# Altium schematic sheet MCU.SchDoc
size A3; SheetNumber: 2; SheetTotal: 6
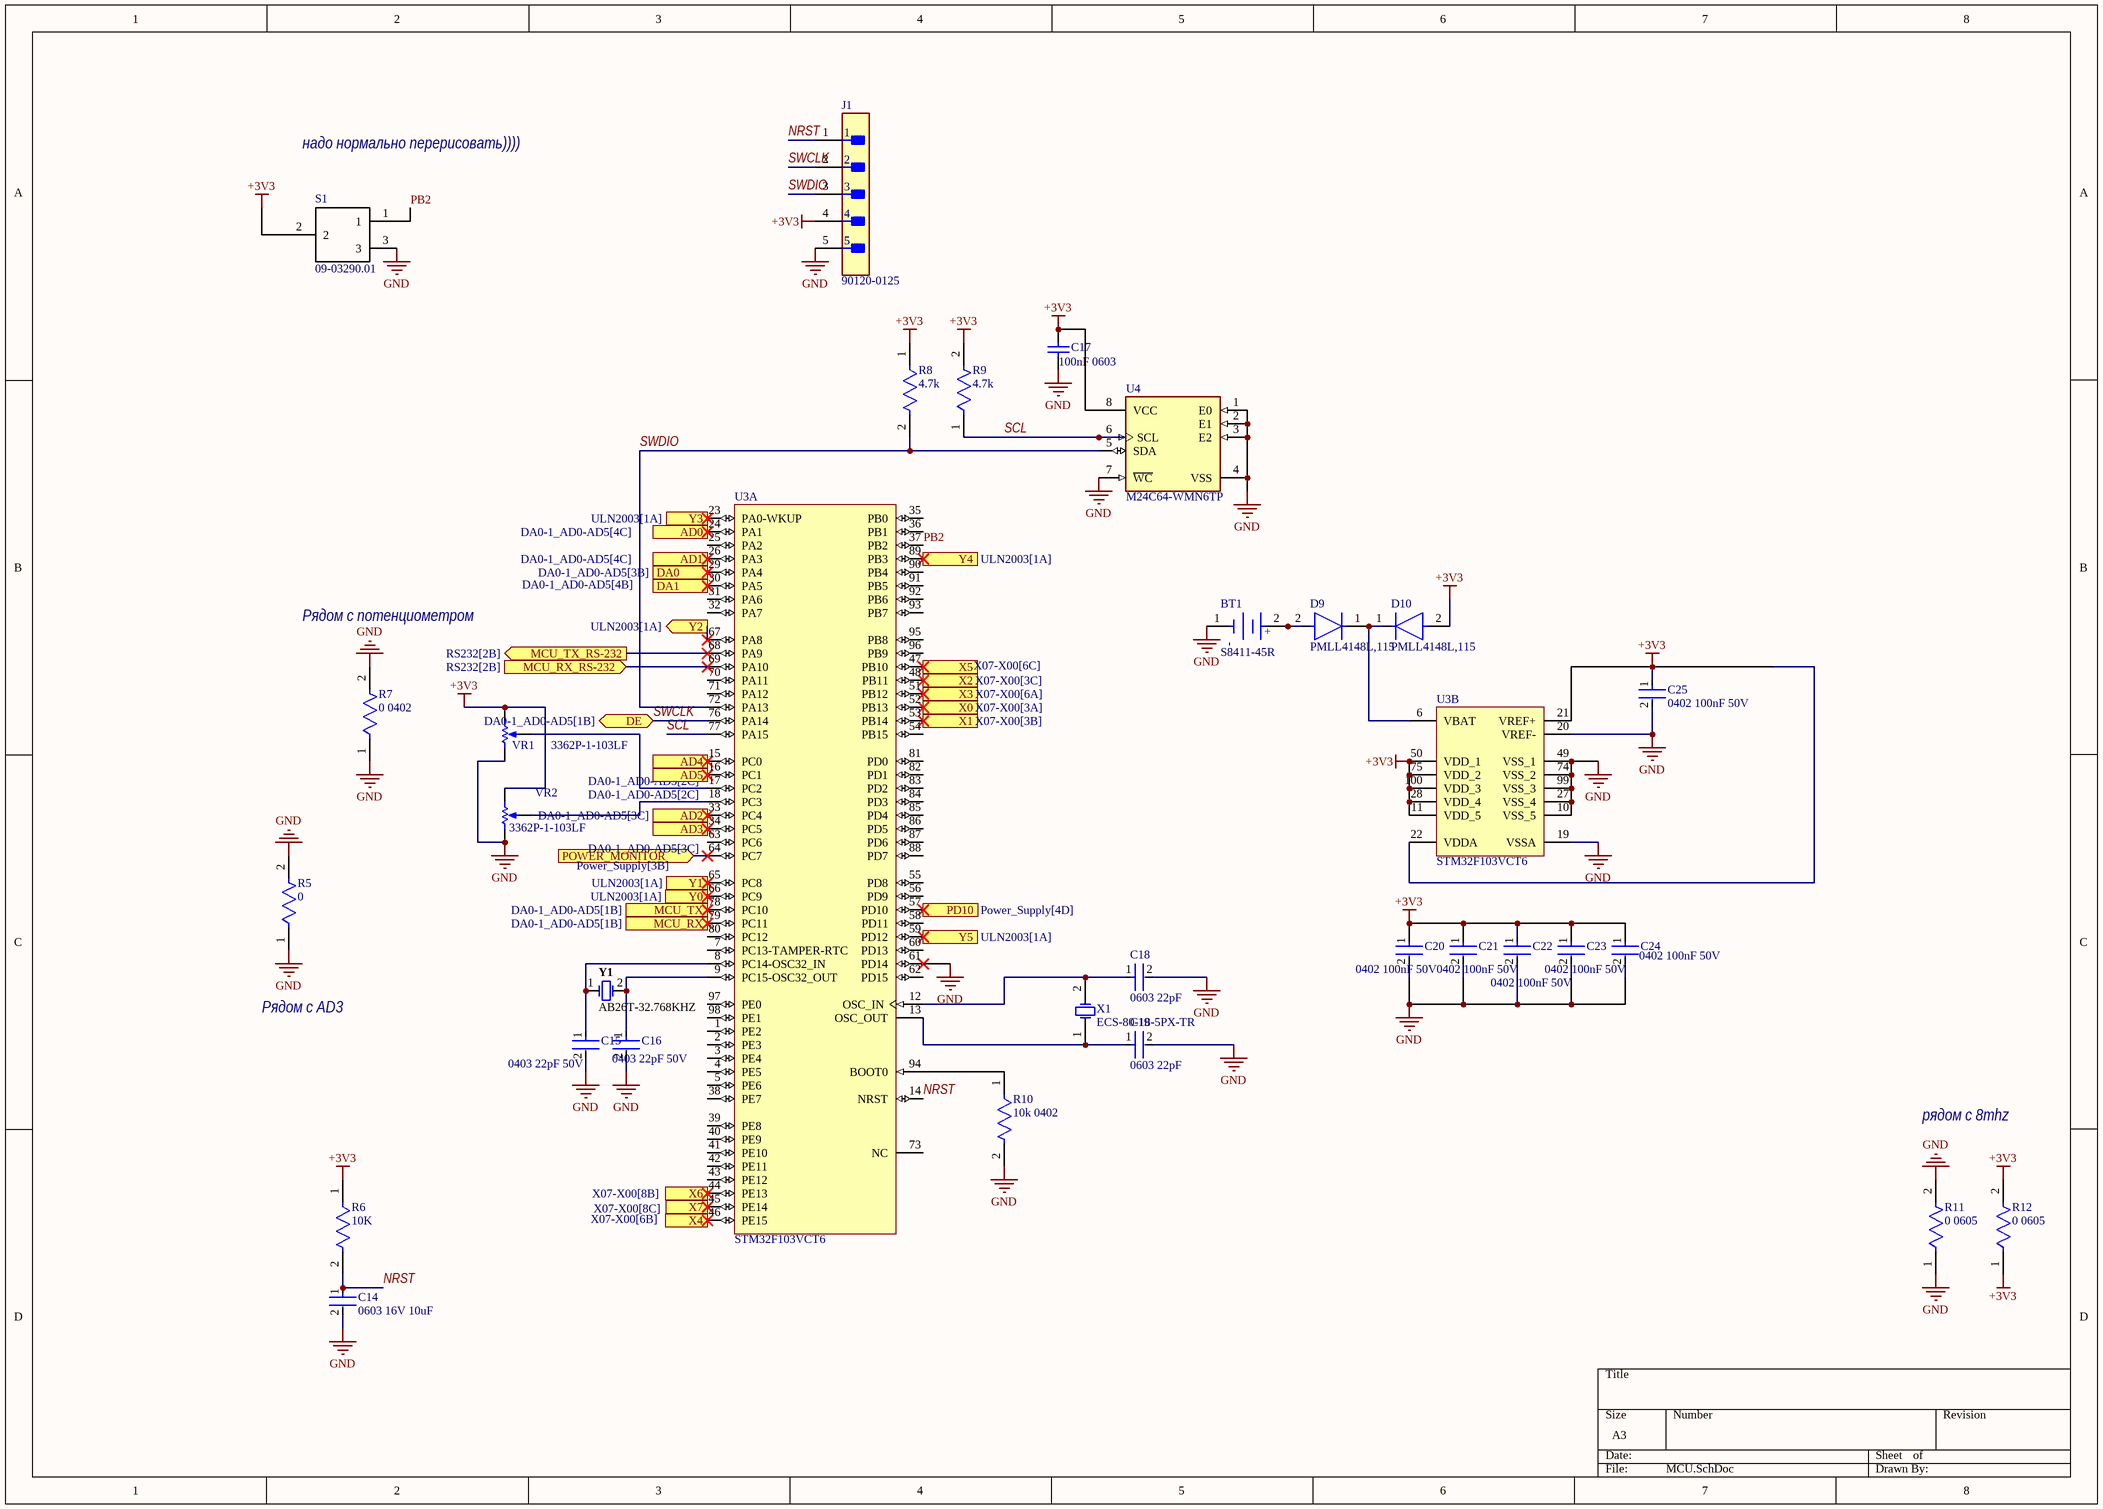
[diagram p0: MCU.SchDoc]

## Parts
BT1  S8411-45R  [FP-S8411-45R-MFG]
C14  0603 16V 10uF  [FP-CC0603-DC-MFG]
C15  0403 22pF 50V  [FP-C0402-BB-MFG]
C16  0403 22pF 50V  [FP-C0402-BB-MFG]
C17  100nF 0603  [CAPC1608X90X35LL15T15]
C18  0603 22pF  [FP-C0603C-CF-MFG]
C19  0603 22pF  [FP-C0603C-CF-MFG]
C20  0402 100nF 50V  [FP-0402B104K500CT-IPC_C]
C21  0402 100nF 50V  [FP-0402B104K500CT-IPC_C]
C22  0402 100nF 50V  [FP-0402B104K500CT-IPC_C]
C23  0402 100nF 50V  [FP-0402B104K500CT-IPC_C]
C24  0402 100nF 50V  [FP-0402B104K500CT-IPC_C]
C25  0402 100nF 50V  [FP-0402B104K500CT-IPC_C]
D9  PMLL4148L,115  [FP-SOD80C-MFG]
D10  PMLL4148L,115  [FP-SOD80C-MFG]
J1  90120-0125  [FP-90120-0125-MFG]
R5  0  [FP-RCS0603-e3-MFG]
R6  10K  [FP-RT0603-MFG]
R7  0 0402  [FP-PMR01-MFG]
R8  4.7k  [FP-TFCR0402-IPC_A]
R9  4.7k  [FP-TFCR0402-IPC_A]
R10  10k 0402  [FP-MCS0402-MFG]
R11  0 0605  [FP-HCJ0603-MFG]
R12  0 0605  [FP-HCJ0603-MFG]
S1  09-03290.01  [09.03290.01]
U3  STM32F103VCT6  [STM-LQFP100_L]  (parts A,B of 2)
U4  M24C64-WMN6TP  [FP-SO8N-SO-A-MFG]
VR1  3362P-1-103LF  [BOUR-3362P]
VR2  3362P-1-103LF  [BOUR-3362P]
X1  ECS-80-18-5PX-TR  [ECS-80-18-5PX-TR_V]
Y1  AB26T-32.768KHZ  [ABRA-AB26T]

## Ports
AD0 (in, see DA0-1_AD0-AD5[4C]), AD1 (in, see DA0-1_AD0-AD5[4C]), AD2 (in, see DA0-1_AD0-AD5[3C]), AD3 (in, see DA0-1_AD0-AD5[3C]), AD4 (in, see DA0-1_AD0-AD5[2C]), AD5 (in, see DA0-1_AD0-AD5[2C]), DA0 (out, see DA0-1_AD0-AD5[3B]), DA1 (out, see DA0-1_AD0-AD5[4B]), DE (bidir, see DA0-1_AD0-AD5[1B]), MCU_RX (in, see DA0-1_AD0-AD5[1B]), MCU_RX_RS-232 (in, see RS232[2B]), MCU_TX (out, see DA0-1_AD0-AD5[1B]), MCU_TX_RS-232 (out, see RS232[2B]), PD10 (out, see Power_Supply[4D]), POWER_MONITOR (in, see Power_Supply[3B]), X0 (in, see X07-X00[3A]), X1 (in, see X07-X00[3B]), X2 (in, see X07-X00[3C]), X3 (in, see X07-X00[6A]), X4 (in, see X07-X00[6B]), X5 (in, see X07-X00[6C]), X6 (in, see X07-X00[8B]), X7 (in, see X07-X00[8C]), Y0 (out, see ULN2003[1A]), Y1 (out, see ULN2003[1A]), Y2 (out, see ULN2003[1A]), Y3 (out, see ULN2003[1A]), Y4 (out, see ULN2003[1A]), Y5 (out, see ULN2003[1A])

## Nets
+3V3: C17.2 C20.1 C21.1 C22.1 C23.1 C24.1 C25.1 D10.2(A) J1.4 R6.1 R8.1 R9.2 R12.1 R12.2 S1.2 U3.11(VDD_5) U3.21(VREF+) U3.22(VDDA) U3.28(VDD_4) U3.50(VDD_1) U3.75(VDD_2) U3.100(VDD_3) U4.8(VCC) VR1.3(CW) VR2.3(CW)
GND: BT1.1(C) C14.2 C15.2 C16.2 C17.1 C18.2 C19.2 C20.2 C21.2 C22.2 C23.2 C24.2 C25.2 J1.5 R5.1 R5.2 R7.1 R7.2 R10.2 R11.1 R11.2 S1.3 U3.10(VSS_5) U3.19(VSSA) U3.20(VREF-) U3.27(VSS_4) U3.49(VSS_1) U3.61(PD14) U3.74(VSS_2) U3.99(VSS_3) U4.1(E0) U4.2(E1) U4.3(E2) U4.4(VSS) U4.7(~{WC}) VR1.1(CCW) VR2.1(CCW)
AD0: U3.24(PA1) ; port AD0
AD1: U3.26(PA3) ; port AD1
AD2: U3.33(PC4) ; port AD2
AD3: U3.34(PC5) ; port AD3
AD4: U3.15(PC0) ; port AD4
AD5: U3.16(PC1) ; port AD5
DA0: U3.29(PA4) ; port DA0
DA1: U3.30(PA5) ; port DA1
MCU_RX: U3.79(PC11) ; port MCU_RX
MCU_RX_RS-232: U3.69(PA10) ; port MCU_RX_RS-232
MCU_TX: U3.78(PC10) ; port MCU_TX
MCU_TX_RS-232: U3.68(PA9) ; port MCU_TX_RS-232
NRST: C14.1 J1.1 R6.2 U3.14(NRST)
PB2: S1.1 U3.37(PB2)
PD10: U3.57(PD10) ; port PD10
POWER_MONITOR: U3.64(PC7) ; port POWER_MONITOR
SCL: R9.1 U3.77(PA15) U4.6(SCL)
SWCLK: J1.2 U3.76(PA14) ; port DE
SWDIO: J1.3 R8.2 U3.72(PA13) U4.5(SDA)
X0: U3.52(PB13) ; port X0
X1: U3.53(PB14) ; port X1
X2: U3.48(PB11) ; port X2
X3: U3.51(PB12) ; port X3
X4: U3.46(PE15) ; port X4
X5: U3.47(PB10) ; port X5
X6: U3.44(PE13) ; port X6
X7: U3.45(PE14) ; port X7
Y0: U3.66(PC9) ; port Y0
Y1: U3.65(PC8) ; port Y1
Y2: U3.67(PA8) ; port Y2
Y3: U3.23(PA0-WKUP) ; port Y3
Y4: U3.89(PB3) ; port Y4
Y5: U3.59(PD12) ; port Y5
NetBT1_2: BT1.2(A) D9.2(A)
NetC15_1: C15.1 U3.8(PC14-OSC32_IN) Y1.1
NetC16_1: C16.1 U3.9(PC15-OSC32_OUT) Y1.2
NetC18_1: C18.1 U3.12(OSC_IN) X1.2(X2)
NetC19_1: C19.1 U3.13(OSC_OUT) X1.1(X1)
NetD9_1: D9.1(C) D10.1(C) U3.6(VBAT)
NetR10_1: R10.1 U3.94(BOOT0)
NetU3_17: U3.17(PC2) VR1.2(S)
NetU3_18: U3.18(PC3) VR2.2(S)

Not connected (* = marked no-connect by the designer): U3 1(PE2) 2(PE3) 3(PE4) 4(PE5) 5(PE6) 7(PC13-TAMPER-RTC) 25(PA2) 31(PA6) 32(PA7) 35(PB0) 36(PB1) 38(PE7) 39(PE8) 40(PE9) 41(PE10) 42(PE11) 43(PE12) 54(PB15) 55(PD8) 56(PD9) 58(PD11) 60(PD13) 62(PD15) 63(PC6) 70(PA11) 71(PA12) 73(NC) 80(PC12) 81(PD0) 82(PD1) 83(PD2) 84(PD3) 85(PD4) 86(PD5) 87(PD6) 88(PD7) 90(PB4) 91(PB5) 92(PB6) 93(PB7) 95(PB8) 96(PB9) 97(PE0) 98(PE1)

## Notes on the sheet
- надо нормально перерисовать))))
- Рядом с потенциометром
- Рядом с AD3
- рядом с 8mhz
- (in symbol CMP-15817-000007-1) +; -

## Library data of the parts
BT1 = CMP-15817-000007-1: BATTERY HOLDER COIN 12MM SMD; Number of Batteries: 1; Material: Polyphenylene; Case/Package: SMD/SMT; Number of Cells: 1; Min Operating Temperature: -55°C; Termination: SMD/SMT; REACH SVHC: No SVHC; Contact Plating: Bronze; Package Quantity: 500; Max Operating Temperature: 105°C; Mount: Surface Mount; Packaging: Tape and Reel
C14 = CMP-00621-81932632-1: CC0603KRX5R7BB106 Multilayer Ceramic Capacitor, 10 uF, 16 V, ± 10%, X5R, 0603 [1608 Metric]; Capacitance: 10µF; NexarPartId: 81932632; Height: 1mm; Halogen Free: Halogen Free; Voltage Rating: 16V; Dielectric: X5R; Max Operating Temperature: 85°C; Voltage Rating (DC): 16V; Material: Ceramic; Lead Free: Lead Free; Tolerance: 10%; RoHS: Non-Compliant; Min Operating Temperature: -55°C; Case/Package: 0603
C15 C16 = CMP-03020-023432-1: C0402 22 pF C0G 5.00% 50 V; Manufacturer: Kemet; Manufacturer Part Number: C0402C220J5GAC; Tolerance: 0.05; Temperature Coefficient: 15%; Material: Ceramic; Lead Free: Yes; Package: C0402-BB; Device Class L3: Ceramic Capacitors; Mouser Description: Cap Ceramic 22pF 50V C0G 5% Pad SMD 0402 125C Bulk; Ipc Land Pattern Name: CAPC10050X50; Device Class L2: Capacitors; Device Class L1: Passive Components; Height: 0.55mm; Temperature Characteristic: C0G; Voltage Rating: 50 V; Automotive: No; ComponentLink2Description: Datasheet; Capacitance: 22 pF; Temperature Range Low: -55°C; Category: Cap; Value: 22 pF; Temperature: -55°C to +125°C; Octopart: https://octopart.com/c0402c220j5gac-kemet-3919113; RoHS: TRUE; ComponentLink2URL: https://content.kemet.com/datasheets/KEM_C1002_X7R_SMD.pdf; Temperature Range High: +125°C
C17 = CMP-2006-04391-1: Manufacturer: AVX Interconnect / Elco; Part Number: 06035C104KAZ2A
C18 C19 = CMP-03020-000148-1: C0603 22 pF X7R 30ppm/°C 5.00% 50 V; Manufacturer: KEMET; Manufacturer Part Number: C0603C220J5RACTU; Automotive Grade: Grade 1; Voltage Rating: 50 V; Tolerance: 0.05; Material: Ceramic; ComponentLink2Description: Datasheet; RoHS: TRUE; Octopart: https://octopart.com/c0603c220j5ractu-kemet-47052364; Temperature Range High: +125°C; Lead Free: Yes; Temperature Range Low: -55°C; Category: Cap; Automotive: Yes; Value: 22 pF; Package: C0603C-CF; Device Class L3: Ceramic Capacitors; Device Class L1: Passive Components; Temperature Characteristic: X7R; Capacitance: 22 pF; Device Class L2: Capacitors; Temperature: -55°C to +125°C; Height: 0.87mm; Temperature Coefficient: 30ppm/°C; ComponentLink2URL: https://api.kemet.com/component-edge/download/datasheet/C0603C100J5GACAUTO.pdf
C20-C25 = CMP-45632-000010-1: CAP CER 0.1UF 50V X7R 0402; Tolerance: 10%; Max Operating Temperature: 125°C; Case Code (Metric): 1005; RoHS Compliant: Yes; Series: -; Case Code (Imperial): 0402; Voltage Rating: 50V; Min Operating Temperature: -55°C; Mount: Surface Mount; Capacitance: 100nF; Case/Package: 0402; Packaging: Cut Tape
D9 D10 = CMP-14399-000003-1: DIODE GEN PURP 75V 200MA LLDS; Manufacturer: Nexperia; Max Junction Temp: +200°C; Capacitance: 4pF; Peak Reverse Current: 0.025uA; Value: 4pF; Max Surge Forward Current: 0.5A; Max Repetitive Reverse Voltage: 100V; Ambient Temperature Range Low: -65°C; Octopart: https://octopart.com/pmll4148l%2C115-nexperia-78741557; ComponentLink2URL: https://assets.nexperia.com/documents/data-sheet/PMLL4148L_PMLL4448.pdf; Ambient Temperature Range High: +200°C; Reverse Voltage: 75V; Device Class L2: Diodes; Height: 1.6mm; Package: SOD80C; Device Class L1: Discrete Semiconductors; Digikey Description: DIODE GEN PURP 75V 200MA LLDS; Lead Free: Yes; Manufacturer Part Number: PMLL4148L,115; Temperature Range High: +200°C; Forward Current: 200mA; ComponentLink2Description: Datasheet; Device Class L3: Rectifier Diodes; Temperature: to +200°C; Automotive: No; RoHS: TRUE; Category: Diode; Footprint Url: https://assets.nexperia.com/documents/outline-drawing/SOD80C.pdf
J1 = CMP-00257-00655425-1: 90120-0125 2.54mm Pitch C-Grid III Header, Single Row, Vertical, 5 Circuits, Tin (Sn) Plating; NexarPartId: 655425; Manufacturer Lifecycle Status: ACTIVE; Lead Length: 2.9mm; Number of Positions: 5; Current Rating: 3A; Mating Post Length: 6.75mm; Glow Wire Compliant: Non-compliant; Contact Resistance: 20mΩ; Voltage Rating: 350V; Gender: Male; Max Voltage Rating (DC): 350.35kV; Max Operating Temperature: 125°C; Number of Pins: 5; Plating: Tin; Contact Material: Brass; Mount: Through Hole; Contact Gender: Male; Packaging: Bulk; Schedule B: 8536694040; Lifecycle Status: Production; Lead Pitch: 2.54mm; Radiation Hardening: No; Orientation: Vertical; Min Operating Temperature: -55°C; Country of Origin: SK; Housing Color: Black; REACH SVHC: No SVHC; Contact Plating: Tin; Number of Rows: 1; Number of Circuits: 5; Termination: Solder; Number of Contacts: 5; Pitch: 2.54mm; Housing Material: Polyester; RoHS: Compliant; Lead Free: Lead Free; Voltage Rating (AC): 350V
R5 = CMP-02407-013117-1: RES SMD 0 OHM JUMPER 1/4W 0603; Max Power Dissipation: 250mW; Resistance: 0R; Case Code (Metric): 1608; Packaging: Cut Tape; RoHS Compliant: Yes; Ratings: AEC-Q200; Max Operating Temperature: 155°C; Resistor Type: Thick Film; Features: Automotive AEC-Q200; Case Code (Imperial): 0603; Number of Terminations: 2; Min Operating Temperature: -55°C; Width: 0.033inch; Height: 0.02inch; Series: RCS e3; Length: 0.061inch; Case/Package: 0603
R6 = CMP-03412-024743-1: RES SMD 10K OHM 0.05% 1/10W 0603; Manufacturer: Yageo; Manufacturer Part Number: RT0603WRE0710KL; Power Rating: 0.1W; Value: 10KΩ; Voltage Rating: 75V; Tolerance: 0.0005; Temperature Coefficient: 50 ppm/°C; Height: 0.55mm; ComponentLink2URL: http://www.yageo.com/documents/recent/PYu-RT_1-to-0.01_RoHS_L_9.pdf; Mouser Description: Res SMD 10K Ohm 0.05% 1/10W 0603; Device Class L1: Passive Components; Octopart: https://octopart.com/rt0603wre0710kl-yageo-71396825; Lead Free: Yes; RoHS: TRUE; ComponentLink2Description: Datasheet; Package: RT0603; Ipc Land Pattern Name: RESC16080X45; Automotive: No; Temperature: -55°C to +155°C; Series: RT; Resistance: 10KΩ; Footprint Url: http://www.yageo.com/exep/pages/download/literatures/PYu-R_Mount_10.pdf; Temperature Range Low: -55°C; Digikey Description: RES SMD 10K OHM 0.05% 1/10W 0603; Category: Res; Device Class L3: Chip SMD Resistors; Temperature Range High: +155°C; Device Class L2: Resistors; Composition: Thin Film
R7 = CMP-08839-031884-1: RES SMD 0 OHM JUMPER 1/5W 0402; Temperature Coefficient: 200ppm/°C; Resistance: 0mR; Max Power Dissipation: 200mW; Case/Package: 0402; Max Operating Temperature: 155°C; Features: Automotive AEC-Q200; Packaging: Tape and Reel; Case Code (Imperial): 0402; Height: 0.01inch; Number of Terminations: 2; Case Code (Metric): 1005; Resistor Type: Thick Film; Length: 0.039inch; RoHS Compliant: Yes; Min Operating Temperature: -55°C; Width: 0.02inch
R8 R9 = CMP-250906-194630-1: RES Thin Film,  4.7kΩ, 0.5%, 0.063W, 25ppm/°C, 0402
R10 = CMP-02407-000363-1: RES SMD 1.2K OHM 1% 1/10W 0402; Power Rating: 100mW; Temperature Coefficient: 25ppm/°C; Tolerance: 0.5%; Voltage Rating: 50V; Resistance: 10kR; Package Quantity: 10000; Case Code (Metric): 1005; Height: 0.015inch; Termination: SMD/SMT; Features: Automotive AEC-Q200; Packaging: Tape and Reel; Length: 0.039inch; Min Operating Temperature: -55°C; Case/Package: 0402; Max Power Dissipation: 100mW; Case Code (Imperial): 0402; Width: 0.5mm; Contact Plating: Tin; Weight: 2.1E-05oz; Max Operating Temperature: 175°C; Composition: Thin Film; Number of Terminations: 2; Radiation Hardening: No
R11 R12 = CMP-26527-000122-1: RES 0 OHM JUMPER 1/4W 0603; Resistance: 0mR; Termination: Wraparound; Mount: Surface Mount; Min Operating Temperature: -55°C; Number of Terminations: 2; Packaging: Tape and Reel; Case Code (Imperial): 0603; Height: 0.021inch; RoHS Compliant: Yes; Width: 0.031inch; Package Quantity: 5000; Max Operating Temperature: 155°C; Radiation Hardening: No; Case/Package: 0603; Length: 0.061inch; Case Code (Metric): 1608
S1 = 09-03290.01: Switch; Manufacturer_Name: EOZ; Manufacturer_Part_Number: 09-03290.01
U3 = CMP-0237-00164-3: ARM Cortex-M3 32-bit MCU, 256 KB Flash, 48 KB Internal RAM, 80 I/Os, 100-pin LQFP, -40 to 85 degC, Tray; FLASH Size (Prog) (kB): 256; I/Os (High Current): 80; Supply Voltage(Vcc) min (V): 2; Operating Frequency(F) (Processor speed) (MHz): 72; Internal RAM Size (kB): 48; A/D Converter: 3x12-bit (16 Channel); D/A Converter: 2x12-bit (2 Channel); PartNumber: STM32F103VCT6; ComponentLink2URL: http://www.st.com/st-web-ui/static/active/en/resource/technical/document/datasheet/CD00191185.pdf; Packing: Tray; ComponentLink3Description: Package Specification; PackageReference: LQFP100; ComponentLink1Description: Manufacturer URL; ComponentLink2Description: Datasheet; PackageDescription: 100-Pin Low Profile Quad Flat Package, 14 x 14 mm Body, 0.5 mm Pitch; DatasheetVersion: Rev. 8; Core: ARM Cortex-M3; ComponentLink1URL: http://www.st.com/web/en/home.html; ComponentLink3URL: http://www.st.com/st-web-ui/static/active/en/resource/technical/document/data_brief/DM00071938.pdf; Mounting Technology: Surface Mount; PackageVersion: Rev. 1, 06/2013
U4 = CMP-12142-000011-1: IC EEPROM 64K I2C 1MHZ 8SO; Manufacturer: STMicroelectronics; Max Supply Voltage: 5.5V; Nominal Supply Current: 2-2.5mA; Min Supply Voltage: 2.5V; Standoff Height: 0.1mm; Memory Size: 64Kbits; Access Time: 900ns; Temperature Range High: +85°C; Mouser Description: EEPROM EEPROM S. I2C 64k; Height: 1.75mm; ComponentLink2Description: Datasheet; Package: SO8N-SO-A; Ipc Land Pattern Name: SOIC127P600X175-8; Lead Free: Yes; Manufacturer Part Number: M24C64-WMN6TP; Temperature Range Low: -40°C; Category: IC; Octopart: https://octopart.com/m24c64-wmn6tp-stmicroelectronics-55412559; Temperature: -40°C to +85°C; Memory Type: EEPROM; Device Class L2: Memory; ComponentLink2URL: https://www.st.com/content/ccc/resource/technical/document/datasheet/5c/df/52/a5/15/f2/48/bd/CD00259166.pdf/files/CD00259166.pdf/jcr:content/translations/en.CD00259166.pdf; Interface: I2C; Frequency: 1MHz; Ambient Temperature Range Low: -40°C; Digikey Description: IC EEPROM 64K I2C 1MHZ 8SO; Device Class L3: EEPROM; Automotive: No; Ambient Temperature Range High: +85°C; Device Class L1: Integrated Circuits (ICs); RoHS: TRUE
VR1 VR2 = CMP-1747-00004-1: Square Trimpot(R) Trimming Potentiometer, 10 KOhm, 300 V, -55 to 125 degC, 3-Pin THD, RoHS, Tube; Voltage Rating: 220 mV; Power Rating: 1 W; Tolerance: 1%; Resistance: 50 mohm; Case/Package: 1206; Length: 3.2 mm; RoHSCompliant: True; PackageDescription: 3-Pin Through Hole Device, Body 6.6 x 6.99 mm, Pitch 2.54 mm; ComponentLink2Description: Datasheet; REACH SVHC: No SVHC; Mount: Surface Mount; Height: 0.6 mm; Packaging: Tape and Reel; ComponentLink1URL: http://www.bourns.com/; Case Code (Imperial): 0612; Pins: 2; Case Code (Metric): 1632; ComponentLink2URL: http://www.bourns.com/docs/Product-Datasheets/3362.pdf; Min Operating Temperature: -25degC; ComponentLink1Description: Manufacturer URL; PackageReference: 3326P; Max Operating Temperature: 125degC; Width: 1.6 mm; Package Quantity: 5000; DatasheetVersion: May-16
X1 = CMP-2000-06193-1: Low Profile Quartz Crystal, 8.0 MHz, 2-Pin SMD, RoHS, Tape and Reel; Brand: ECS; Tolerance: 30PPM; Case Height: 4.3mm; Frequency: 8MHz; Frequency Stability: 50PPM; Case Length: 13.2mm; Case Width: 4.8mm; Load Capacitance: 18pF; Termination Style: SMD/SMT; Product Category: Crystals; Packaging: Reel; Package Reference: ECS-80-18-5PX-TR; Mounting Technology: SurfaceMount; Dimensions: 4.8mmWx13.2mmLx4.3mmH; Package Description: 2-Pin Surface Mount Device, Body 11.4 x 4.8 mm, Height 4.3 mm; Datasheet URL: https://www.ecsxtal.com/store/pdf/csm-7x.pdf; Datasheet Version: 05/2016; Manufacturer: ECS; Factory Pack Quantity: 1000; Manufacturer URL: https://www.ecsxtal.com/; Type: SMDQuartzCrystals; Mounting Style: SMD/SMT; Package / Case: HC-49/US; Operating Temperature Range: -10Cto+70C; RoHS: Details; Series: CSM-7X
Y1 = CMP-2000-05723-1: Crystal, 12.5 pF, 32.768 KHz, -10 to 60 degC, 2-Pin THD, RoHS, Bulk; Manufacturer: ABRACON; ESR: 35kOhms; Frequency Stability: -0.034PPM; Load Capacitance: 12.5pF; Tolerance: 20PPM; Case Length: 6.2mm; Case Diameter: 2.1mm; RoHS: Details; Product Category: Crystals; Type: WatchCrystal; Manufacturer URL: http://www.abracon.com/; Operating Temperature Range: -10Cto+60C; Package Description: 2-Pin Through Hole Device, Dia 2.1 mm, Body Length 6.2 mm; Termination Style: Radial; Datasheet Version: 06/2010; Datasheet URL: http://www.abracon.com/Resonators/AB26T.pdf; Packaging: Bulk; Factory Pack Quantity: 500; Brand: ABRACON; Mounting Technology: ThroughHole; Package URL: http://www.abracon.com/Support/PackageDrawing/Resonators/AB26T.PDF; Package / Case: Cylinder; Lead Spacing: 0.8mm; Dimensions: 2.1mmDia.x6.2mmL; Mounting Style: ThroughHole; Frequency: 32.768kHz; Package Reference: AB26T; Series: AB26T